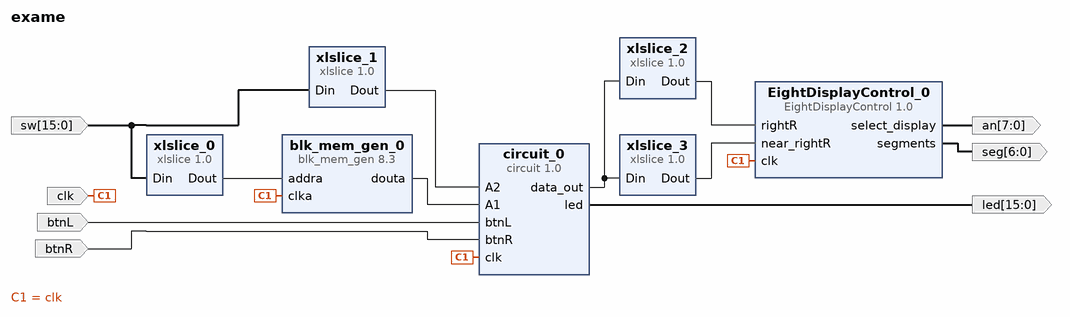
[diagram p0: block diagram of the top level]
# Vivado block design exame, Vivado 2015.4
create_bd_design exame

create_bd_port -dir I clk
create_bd_port -dir I -from 15 -to 0 sw
create_bd_port -dir I btnL
create_bd_port -dir I btnR
create_bd_port -dir O -from 15 -to 0 led
create_bd_port -dir O -from 7 -to 0 an
create_bd_port -dir O -from 6 -to 0 seg

create_bd_cell -type ip -vlnv xilinx.com:ip:blk_mem_gen:8.3 blk_mem_gen_0
set_property -dict [list \
  CONFIG.Memory_Type Single_Port_ROM \
  CONFIG.Enable_32bit_Address false \
  CONFIG.Write_Width_A 4 \
  CONFIG.Write_Depth_A 4 \
  CONFIG.Enable_A Always_Enabled \
  CONFIG.Register_PortA_Output_of_Memory_Primitives false \
  CONFIG.Load_Init_File true \
  CONFIG.Coe_File ../../../../../../../../../Memoria/4words4bits_3.coe \
  CONFIG.Use_RSTA_Pin false \
  CONFIG.Port_A_Write_Rate 0 \
  CONFIG.use_bram_block Stand_Alone \
] [get_bd_cells blk_mem_gen_0]
create_bd_cell -type ip -vlnv xilinx.com:ip:xlslice:1.0 xlslice_0
set_property -dict {CONFIG.DOUT_WIDTH 2 CONFIG.DIN_TO 14 CONFIG.DIN_FROM 15 CONFIG.DIN_WIDTH 16} [get_bd_cells xlslice_0]
create_bd_cell -type ip -vlnv xilinx.com:ip:xlslice:1.0 xlslice_1
set_property -dict {CONFIG.DOUT_WIDTH 4 CONFIG.DIN_TO 0 CONFIG.DIN_FROM 3 CONFIG.DIN_WIDTH 16} [get_bd_cells xlslice_1]
create_bd_cell -type ip -vlnv ua.pt:user:EightDisplayControl:1.0 EightDisplayControl_0
create_bd_cell -type ip -vlnv xilinx.com:ip:xlslice:1.0 xlslice_2
set_property -dict {CONFIG.DOUT_WIDTH 4 CONFIG.DIN_TO 0 CONFIG.DIN_FROM 3 CONFIG.DIN_WIDTH 8} [get_bd_cells xlslice_2]
create_bd_cell -type ip -vlnv xilinx.com:ip:xlslice:1.0 xlslice_3
set_property -dict {CONFIG.DOUT_WIDTH 4 CONFIG.DIN_TO 4 CONFIG.DIN_FROM 7 CONFIG.DIN_WIDTH 8} [get_bd_cells xlslice_3]
create_bd_cell -type ip -vlnv user.org:user:circuit:1.0 circuit_0

# ---- connections ----

connect_bd_net [get_bd_ports clk] [get_bd_pins blk_mem_gen_0/clka] [get_bd_pins EightDisplayControl_0/clk] [get_bd_pins circuit_0/clk]
connect_bd_net [get_bd_ports sw] [get_bd_pins xlslice_0/Din] [get_bd_pins xlslice_1/Din]
connect_bd_net [get_bd_pins xlslice_0/Dout] [get_bd_pins blk_mem_gen_0/addra]
connect_bd_net [get_bd_ports btnL] [get_bd_pins circuit_0/btnL]
connect_bd_net [get_bd_ports btnR] [get_bd_pins circuit_0/btnR]
connect_bd_net [get_bd_pins xlslice_1/Dout] [get_bd_pins circuit_0/A2]
connect_bd_net [get_bd_pins blk_mem_gen_0/douta] [get_bd_pins circuit_0/A1]
connect_bd_net [get_bd_pins circuit_0/led] [get_bd_ports led]
connect_bd_net [get_bd_pins circuit_0/data_out] [get_bd_pins xlslice_2/Din] [get_bd_pins xlslice_3/Din]
connect_bd_net [get_bd_pins xlslice_2/Dout] [get_bd_pins EightDisplayControl_0/rightR]
connect_bd_net [get_bd_pins xlslice_3/Dout] [get_bd_pins EightDisplayControl_0/near_rightR]
connect_bd_net [get_bd_pins EightDisplayControl_0/select_display] [get_bd_ports an]
connect_bd_net [get_bd_pins EightDisplayControl_0/segments] [get_bd_ports seg]

validate_bd_design
save_bd_design
